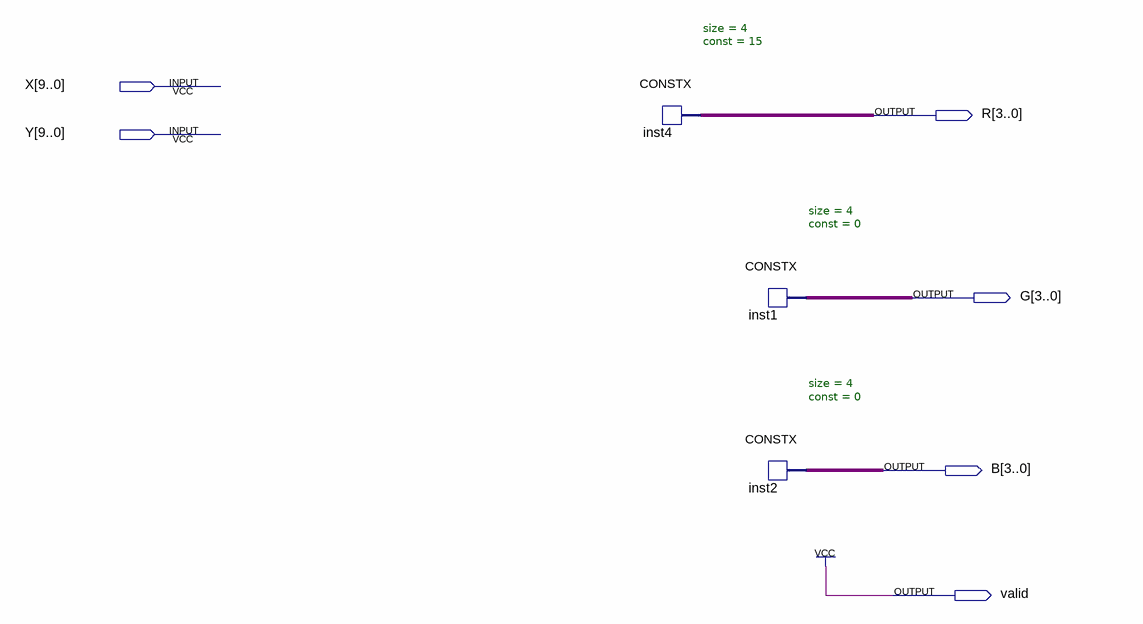
[diagram p0: schematic sheet]
// Quartus schematic Izgubio.bdf as structural Verilog: 3 symbols, 6 pins
module Izgubio (
  input  [9:0] X,
  input  [9:0] Y,
  output [3:0] R,
  output [3:0] G,
  output [3:0] B,
  output valid
);

  CONSTX #(.size(4), .\const (15)) inst4 (.data(R));
  CONSTX #(.size(4), .\const (0)) inst1 (.data(G));
  CONSTX #(.size(4), .\const (0)) inst2 (.data(B));

  assign valid = 1'b1;
endmodule
